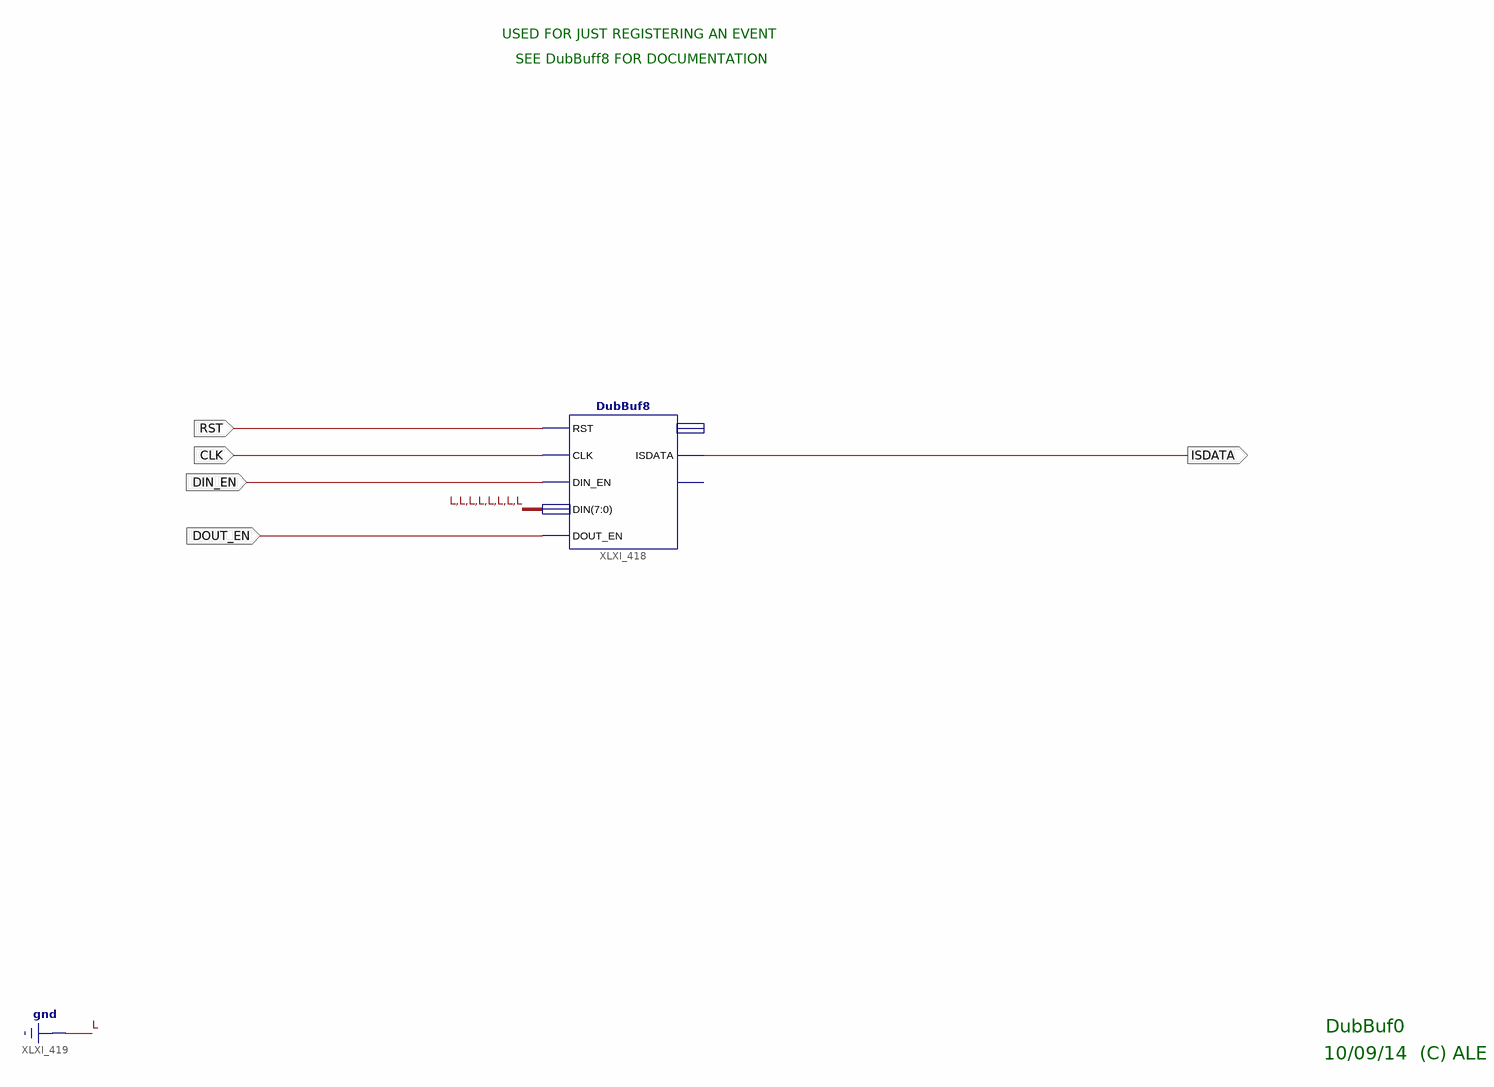
[diagram p0: schematic sheet 1]
// Xilinx ISE schematic DubBuf0.sch (spartan3e) as structural Verilog: 1 symbols, 5 ports
module DubBuf0 (
  input  RST,
  input  CLK,
  input  DIN_EN,
  input  DOUT_EN,
  output ISDATA
);

  DubBuf8 XLXI_418 (
    .CLK(CLK), .DIN({8{1'b0}}), .DIN_EN(DIN_EN), .DOUT_EN(DOUT_EN), .ISDATA(ISDATA), .RST(RST));  // open: DOUT, OVERFLOW

  // Notes on the sheet:
  //   USED FOR JUST REGISTERING AN EVENT
  //   SEE DubBuff8 FOR DOCUMENTATION
  //   DubBuf0
  //   10/09/14  (C) ALE
endmodule
